# EAGLE design PQ60 CB FV2 (EAGLE 7.4.0)
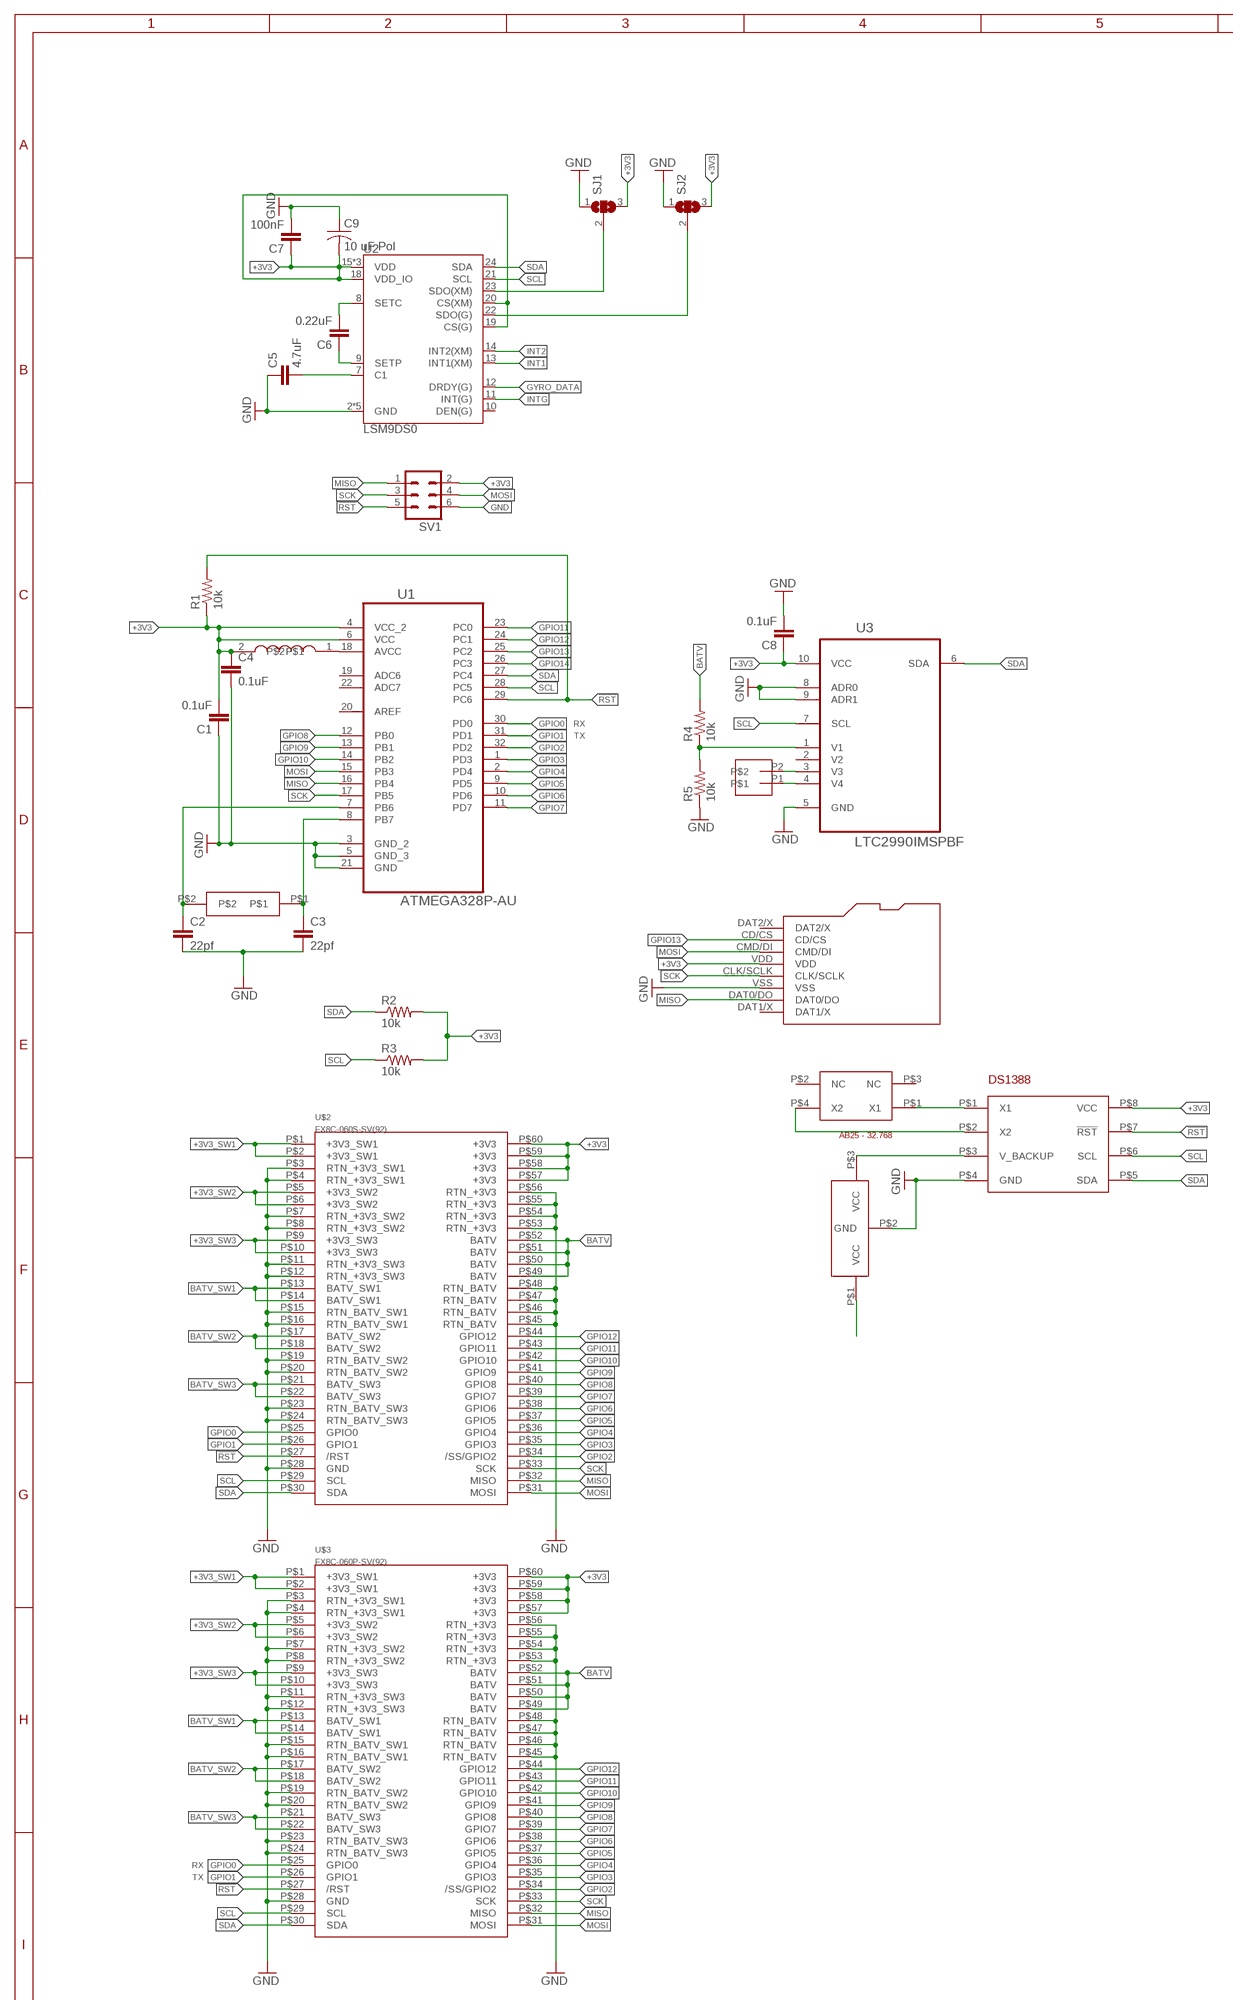
[diagram p0: schematic, sheet 1, part 1 of 2]
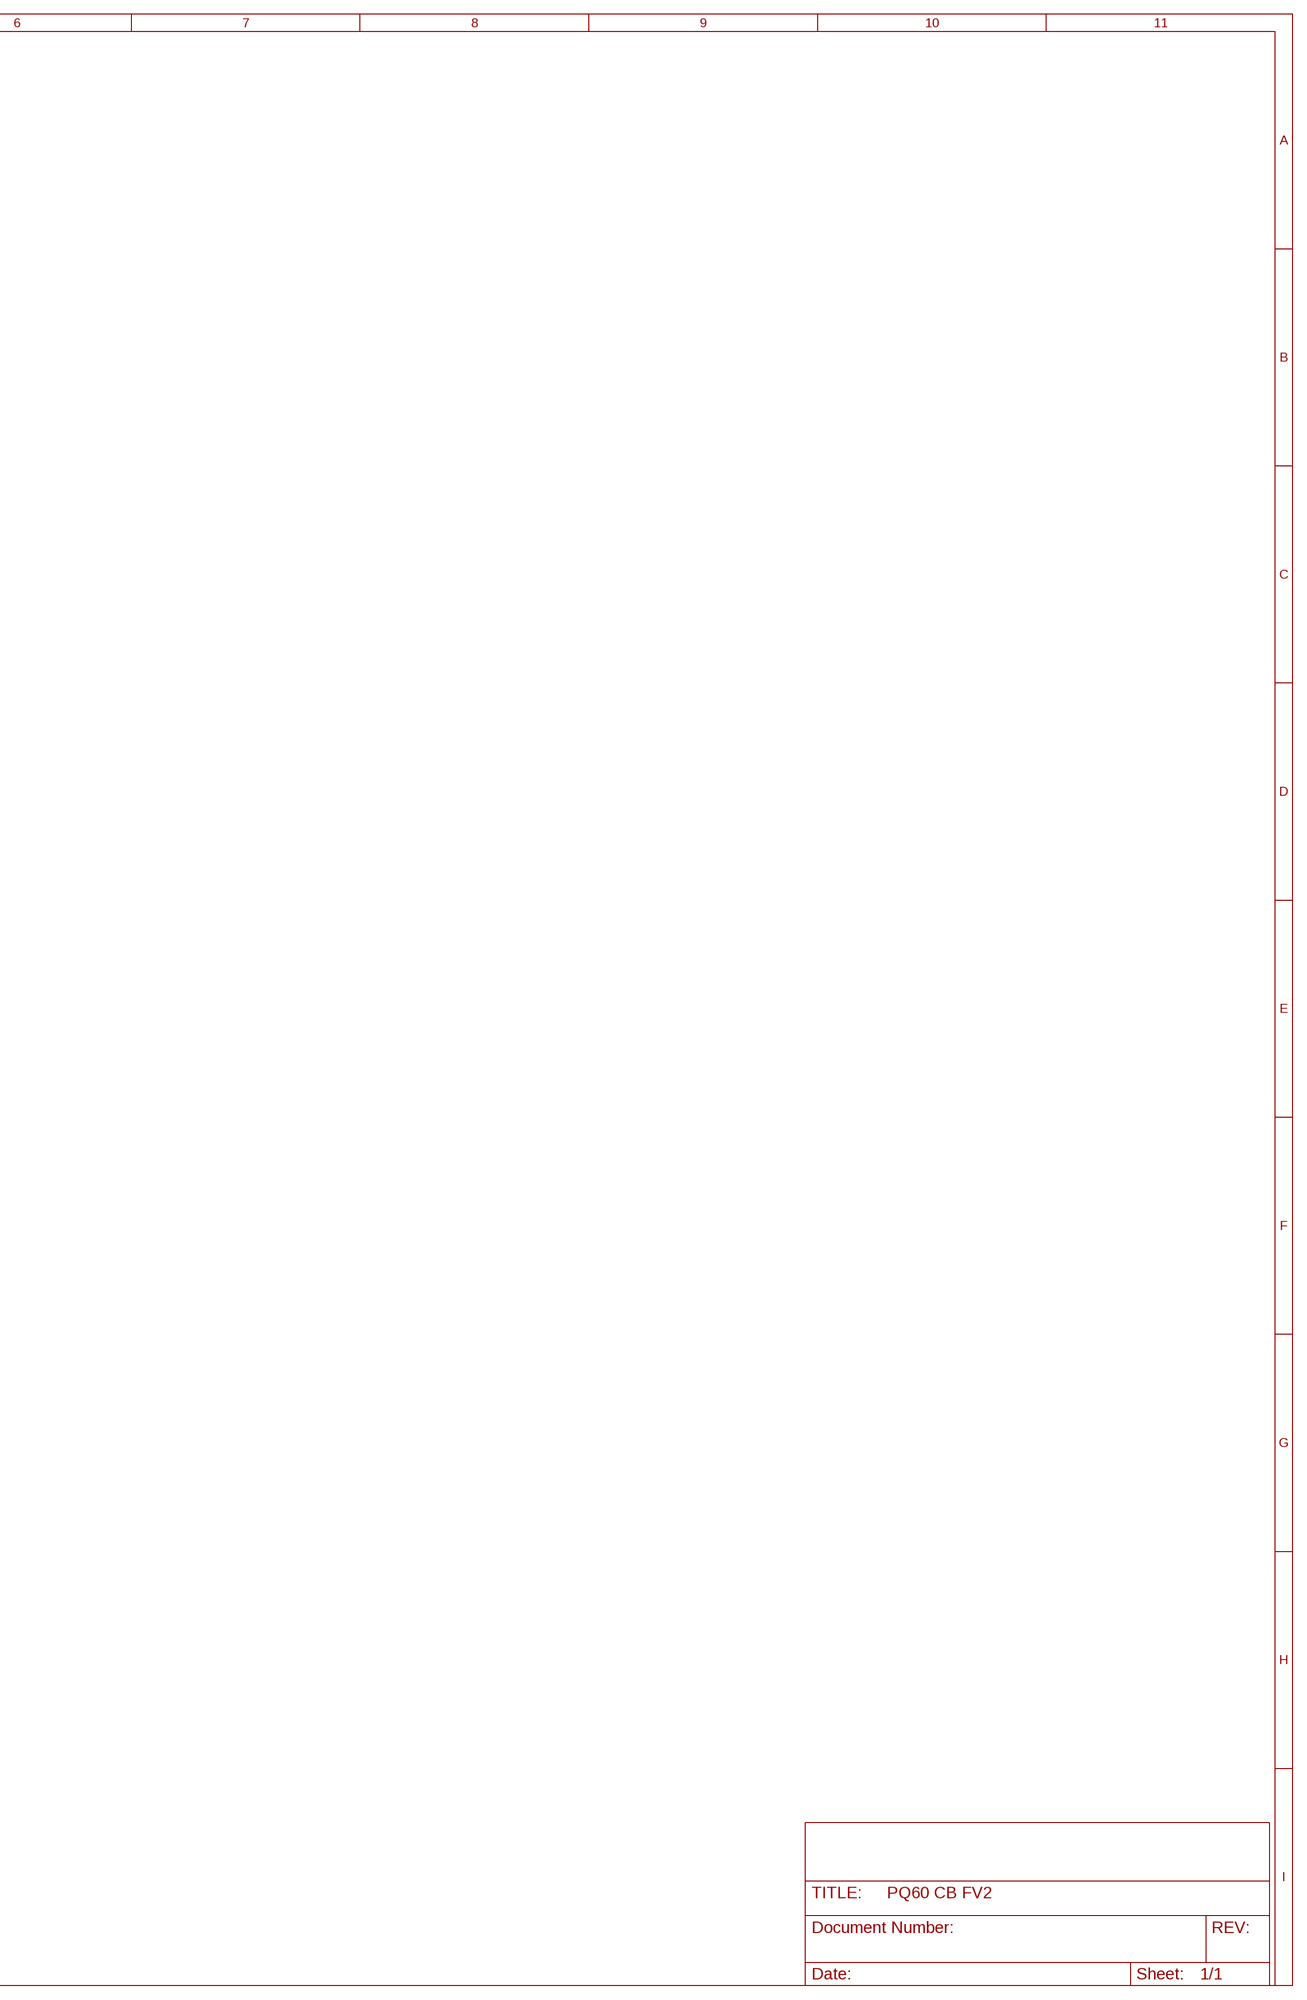
[diagram p1: schematic, sheet 1, part 2 of 2]

## Parts
C1  0.1uF  C-EUC0805  [C0805]
C2  22pf  C-EUC0805  [C0805]
C3  22pf  C-EUC0805  [C0805]
C4  0.1uF  C-EUC0805  [C0805]
C5  4.7uF  C-EUC0805  [C0805]
C6  0.22uF  C-EUC0805  [C0805]
C7  100nF  C-EUC0805  [C0805]
C8  0.1uF  C-EUC0805  [C0805]
C9  10 uF Pol  C-USC0805  [C0805]
R1  10k  R-US_R0805  [R0805]
R2  10k  R-US_M0805  [M0805]
R3  10k  R-US_M0805  [M0805]
R4  10k  R-US_M0805  [M0805]
R5  10k  R-US_M0805  [M0805]
SJ1  SJ2W  [SJ_2]
SJ2  SJ2W  [SJ_2]
SV1  MA03-2  [MA03-2]
U1  ATMEGA328P-AU  [QFP80P900X900X120-32N]
U2  LSM9DS0  [LGA-24]
U3  LTC2990IMSPBF  [SOP50P490X110-10N]
U$2  FX8C-060S-SV(92)  [FX8C-060S-SV(92)]
U$3  FX8C-060P-SV(92)  [FX8C-060P-SV(92)]
U$4  AB3-47699  [ABM#-47699]
U$5  1210-047J  [1210-047J]
U$6  MICROSD  [MICROSD]
U$7  JST-SH-02  [JST-SH-02]
U$8  DS1388  [DS1388]
U$9  AB25  [ABS25]
U$10  6.8MM-BATTERY  [6.8MM-BATTERY]

## Nets
!RST: R1.2 SV1.5 U1.29(PC6) U$2.P$27(/RST) U$3.P$27(/RST) U$8.P$7(!RST)
+3V3: C1.2 C4.1 C7.1 C8.1 C9.2 R1.1 R2.2 R3.2 SJ1.3 SJ2.3 SV1.2 U1.4(VCC_2) U1.6(VCC) U2.15(VDD) U2.16(VDD) U2.17(VDD) U2.18(VDD_IO) U2.19(CS(G)) U2.20(CS(XM)) U3.10(VCC) U$2.P$57(+3V3) U$2.P$58(+3V3) U$2.P$59(+3V3) U$2.P$60(+3V3) U$3.P$57(+3V3) U$3.P$58(+3V3) U$3.P$59(+3V3) U$3.P$60(+3V3) U$5.2 U$6.VDD U$8.P$8(VCC)
+3V3_SW1: U$2.P$1(+3V3_SW1) U$2.P$2(+3V3_SW1) U$3.P$1(+3V3_SW1) U$3.P$2(+3V3_SW1)
+3V3_SW2: U$2.P$5(+3V3_SW2) U$2.P$6(+3V3_SW2) U$3.P$5(+3V3_SW2) U$3.P$6(+3V3_SW2)
+3V3_SW3: U$2.P$9(+3V3_SW3) U$2.P$10(+3V3_SW3) U$3.P$9(+3V3_SW3) U$3.P$10(+3V3_SW3)
BATV: R4.2 U$2.P$49(BATV) U$2.P$50(BATV) U$2.P$51(BATV) U$2.P$52(BATV) U$3.P$49(BATV) U$3.P$50(BATV) U$3.P$51(BATV) U$3.P$52(BATV)
BATV_SW1: U$2.P$13(BATV_SW1) U$2.P$14(BATV_SW1) U$3.P$13(BATV_SW1) U$3.P$14(BATV_SW1)
BATV_SW2: U$2.P$17(BATV_SW2) U$2.P$18(BATV_SW2) U$3.P$17(BATV_SW2) U$3.P$18(BATV_SW2)
BATV_SW3: U$2.P$21(BATV_SW3) U$2.P$22(BATV_SW3) U$3.P$21(BATV_SW3) U$3.P$22(BATV_SW3)
GND: C1.1 C2.2 C3.2 C4.2 C5.1 C7.2 C8.2 C9.1 R5.1 SJ1.1 SJ2.1 SV1.6 U1.3(GND_2) U1.5(GND_3) U1.21(GND) U2.2(GND) U2.3(GND) U2.4(GND) U2.5(GND) U2.6(GND) U3.5(GND) U3.8(ADR0) U3.9(ADR1) U$2.P$3(RTN_+3V3_SW1) U$2.P$4(RTN_+3V3_SW1) U$2.P$7(RTN_+3V3_SW2) U$2.P$8(RTN_+3V3_SW2) U$2.P$11(RTN_+3V3_SW3) U$2.P$12(RTN_+3V3_SW3) U$2.P$15(RTN_BATV_SW1) U$2.P$16(RTN_BATV_SW1) U$2.P$19(RTN_BATV_SW2) U$2.P$20(RTN_BATV_SW2) U$2.P$23(RTN_BATV_SW3) U$2.P$24(RTN_BATV_SW3) U$2.P$28(GND) U$2.P$45(RTN_BATV) U$2.P$46(RTN_BATV) U$2.P$47(RTN_BATV) U$2.P$48(RTN_BATV) U$2.P$53(RTN_+3V3) U$2.P$54(RTN_+3V3) U$2.P$55(RTN_+3V3) U$2.P$56(RTN_+3V3) U$3.P$3(RTN_+3V3_SW1) U$3.P$4(RTN_+3V3_SW1) U$3.P$7(RTN_+3V3_SW2) U$3.P$8(RTN_+3V3_SW2) U$3.P$11(RTN_+3V3_SW3) U$3.P$12(RTN_+3V3_SW3) U$3.P$15(RTN_BATV_SW1) U$3.P$16(RTN_BATV_SW1) U$3.P$19(RTN_BATV_SW2) U$3.P$20(RTN_BATV_SW2) U$3.P$23(RTN_BATV_SW3) U$3.P$24(RTN_BATV_SW3) U$3.P$28(GND) U$3.P$45(RTN_BATV) U$3.P$46(RTN_BATV) U$3.P$47(RTN_BATV) U$3.P$48(RTN_BATV) U$3.P$53(RTN_+3V3) U$3.P$54(RTN_+3V3) U$3.P$55(RTN_+3V3) U$3.P$56(RTN_+3V3) U$6.VSS U$8.P$4(GND) U$10.P$2(GND)
GPIO0: U1.30(PD0) U$2.P$25(GPIO0) U$3.P$25(GPIO0)
GPIO1: U1.31(PD1) U$2.P$26(GPIO1) U$3.P$26(GPIO1)
GPIO2: U1.32(PD2) U$2.P$34(/SS/GPIO2) U$3.P$34(/SS/GPIO2)
GPIO3: U1.1(PD3) U$2.P$35(GPIO3) U$3.P$35(GPIO3)
GPIO4: U1.2(PD4) U$2.P$36(GPIO4) U$3.P$36(GPIO4)
GPIO5: U1.9(PD5) U$2.P$37(GPIO5) U$3.P$37(GPIO5)
GPIO6: U1.10(PD6) U$2.P$38(GPIO6) U$3.P$38(GPIO6)
GPIO7: U1.11(PD7) U$2.P$39(GPIO7) U$3.P$39(GPIO7)
GPIO8: U1.12(PB0) U$2.P$40(GPIO8) U$3.P$40(GPIO8)
GPIO9: U1.13(PB1) U$2.P$41(GPIO9) U$3.P$41(GPIO9)
GPIO10: U1.14(PB2) U$2.P$42(GPIO10) U$3.P$42(GPIO10)
GPIO11: U1.23(PC0) U$2.P$43(GPIO11) U$3.P$43(GPIO11)
GPIO12: U1.24(PC1) U$2.P$44(GPIO12) U$3.P$44(GPIO12)
GPIO13: U1.25(PC2) U$6.CD/CS
GPIO14: U1.26(PC3)
GYRO_DATA: U2.12(DRDY(G))
INT1: U2.13(INT1(XM))
INT2: U2.14(INT2(XM))
INTG: U2.11(INT(G))
MISO: SV1.1 U1.16(PB4) U$2.P$32(MISO) U$3.P$32(MISO) U$6.DAT0/DO
MOSI: SV1.4 U1.15(PB3) U$2.P$31(MOSI) U$3.P$31(MOSI) U$6.CMD/DI
N$1: R4.1 R5.2 U3.1(V1)
N$2: C3.1 U1.8(PB7) U$4.P$1
N$3: C2.1 U1.7(PB6) U$4.P$2
N$4: U1.18(AVCC) U$5.1
N$5: C5.2 U2.7(C1)
N$6: C6.2 U2.8(SETC)
N$7: C6.1 U2.9(SETP)
N$8: SJ1.2 U2.23(SDO(XM))
N$9: SJ2.2 U2.22(SDO(G))
N$10: U3.3(V3) U$7.P2
N$11: U3.4(V4) U$7.P1
N$14: U$10.P$1(VCC)
N$18: U$8.P$1(X1) U$9.P$1(X1)
N$19: U$8.P$2(X2) U$9.P$4(X2)
N$20: U$8.P$3(V_BACKUP) U$10.P$3(VCC)
SCK: SV1.3 U1.17(PB5) U$2.P$33(SCK) U$3.P$33(SCK) U$6.CLK/SCLK
SCL: R3.1 U1.28(PC5) U2.21(SCL) U3.7(SCL) U$2.P$29(SCL) U$3.P$29(SCL) U$8.P$6(SCL)
SDA: R2.1 U1.27(PC4) U2.24(SDA) U3.6(SDA) U$2.P$30(SDA) U$3.P$30(SDA) U$8.P$5(SDA)
Unconnected: U1.19(ADC6) U1.20(AREF) U1.22(ADC7) U2.10(DEN(G)) U3.2(V2) U$6.DAT1/X U$6.DAT2/X U$9.P$2(NC) U$9.P$3(NC)

## Notes on the sheet
- RX
- TX
- RX
- TX

## Library data of the parts
C1-C4 = resistor:C-EU: CAPACITOR, European symbol
C5-C8 = rcl:C-EU: CAPACITOR, European symbol
C9 = adafruit:C-US: CAPACITOR, American symbol
R1-R3 = adafruit:R-US_: RESISTOR, American symbol
R4 R5 = resistor:R-US_: RESISTOR, American symbol
SJ1 SJ2 = jumper:SJ2W: SMD solder JUMPER
SV1 = con-lstb:MA03-2: PIN HEADER; OC_FARNELL: unknown; OC_NEWARK: unknown
U1 = atmega328p:ATMEGA328P-AU: 8-bit Microcontroller with In-System Programmable Flash; MPN: ATMEGA328P-AU; OC_FARNELL: 1715486; OC_NEWARK: 14R4631; PACKAGE: TQFP-32; SUPPLIER: Atmel
U2 = SparkFun-DigitalIC:LSM9DS0: LSM9DS0 3D Accelerometer, 3D Gyroscope, 3D Magnetomter Features: 3 acceleration channels, 3 angular rate channels, 3 magnetic field channels ±2/±4/±6/±8/±16 g linear acceleration full scale ±2/±4/±8/±12 gauss magnetic full scale ±245/±500/±2000 dps angular rate full scale 16-bit data output SPI / I2C serial interfaces Analog supply voltage 2.4 V to 3.6 V Power-down mode / low-power mode Programmable interrupt generators Embedded self-test Embedded temperature sensor Embedded FIFO Position and motion detection functions Click/double-click recognition
U3 = LTC2990:LTC2990IMSPBF: I2C Temperature, Voltage and Current Monitor; MPN: LTC2990IMS#PBF; OC_FARNELL: 1898629; OC_NEWARK: 13T3889; PACKAGE: MSOP-10; SUPPLIER: Linear Technology
U$2 = PQ60:FX8C-060S-SV(92)
U$3 = PQ60:FX8C-060P-SV(92)
U$4 = abm3-16:AB3-47699
U$5 = 1210-047J:1210-047J
U$6 = mircosd:MICROSD
U$7 = JST SH 02:JST-SH-02
U$8 = DS1388:DS1388
U$9 = AB25:AB25
U$10 = 6.8mm-battery:6.8MM-BATTERY

## Net classes
0 default: clearance 0.205 mm

## Board
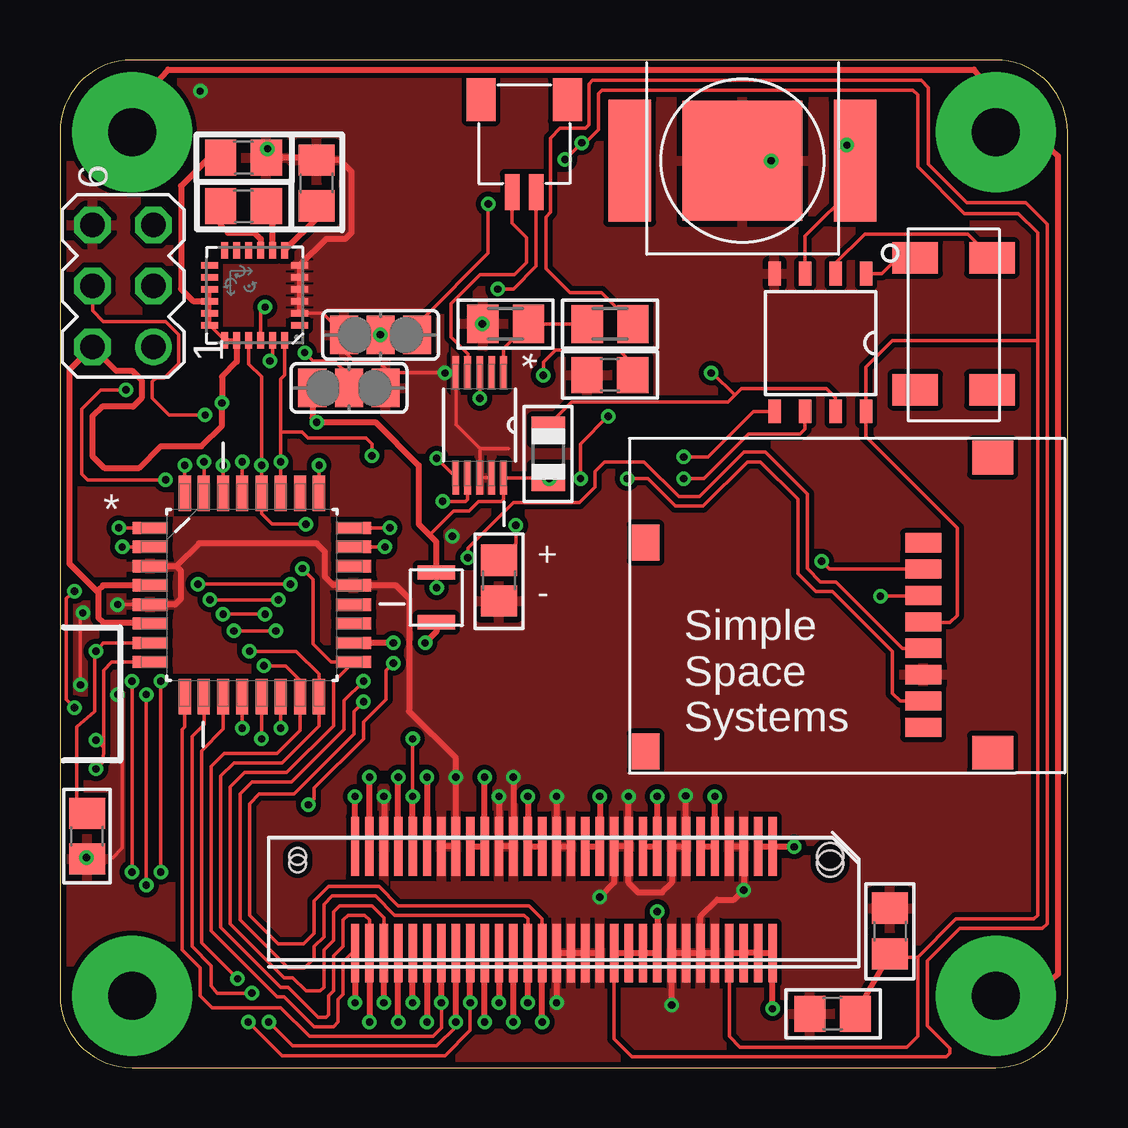
[diagram p2: board, top side]
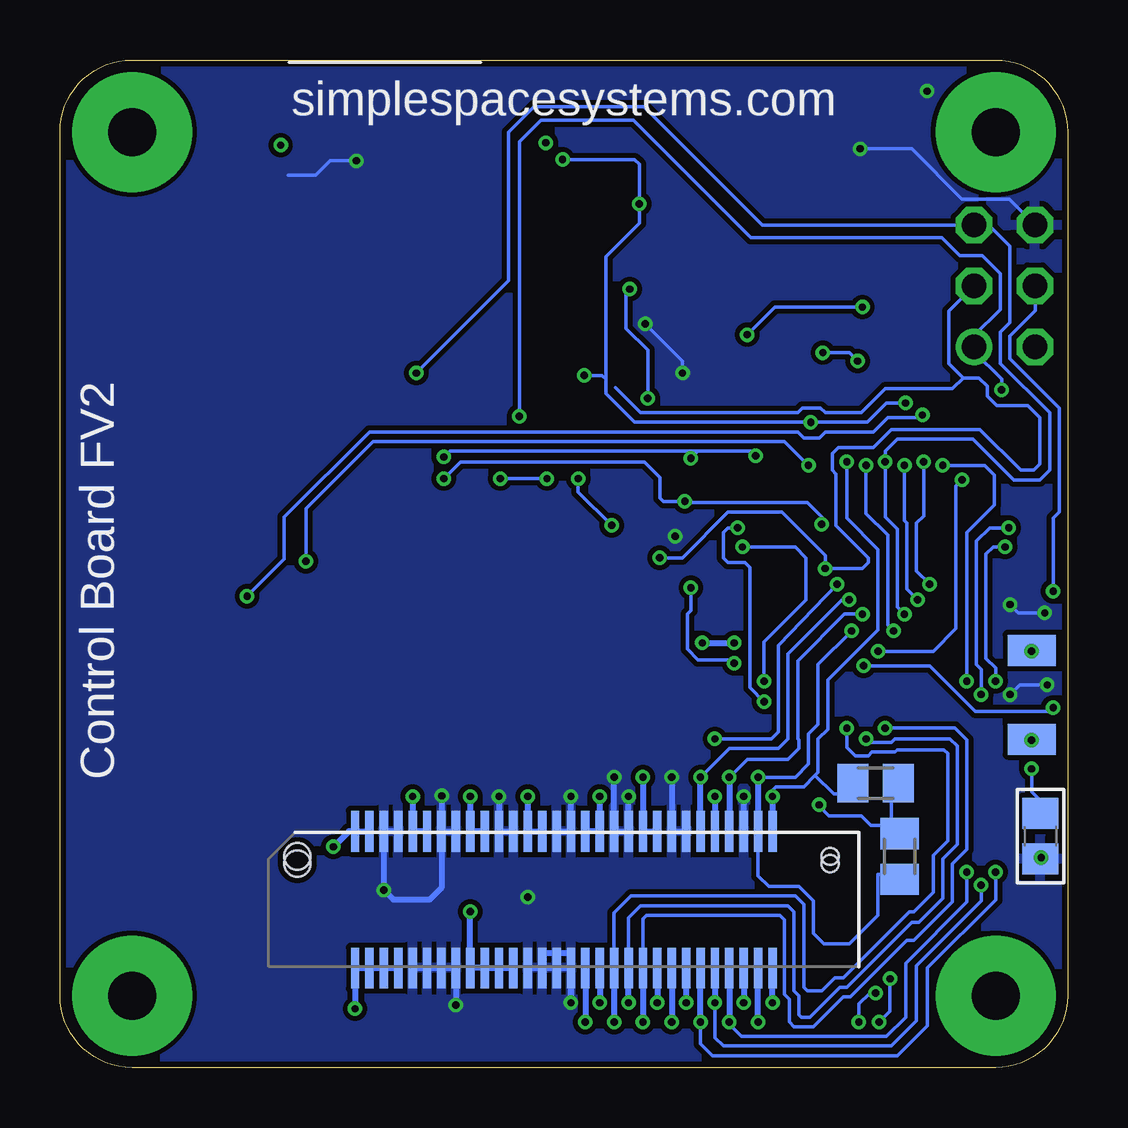
[diagram p3: board, bottom side, seen from below]

Size 42 x 42 mm. Coordinates in mm from the lower left corner, seen from the top.
Outline: 42,3 42,39 arc90 39,42 3,42 arc90 0,39 0,3 arc90 3,0 39,0 arc90 42,3
Copper layers (1*16): Top 0.035mm / dielectric 1.5mm / Bottom 0.035mm
Design rules "SeeedStudio_2layer_DRU_no_angle_20140221 *": minimum track width 6mil, minimum drill 0.3mm, track to track 6mil, track to pad 6mil, pad to pad 6mil, via to via 6mil, smd to smd 0mil, copper to edge 10mil, drill to drill 10mil, minimum pad ring 10mil, minimum via ring 6mil, stop-mask expansion 2mil, vias tented up to drill 100mil, thermal gap 10mil

### Footprints (pad centres in the part's own frame; a part is rotated, then mirrored left to right if it is on the bottom)
C0805 = smd 1.3 x 1.5: 1 -0.95,0; 2 0.95,0
C0805' = smd 1.3 x 1.5: 1 -0.85,0; 2 0.85,0
R0805 = smd 1.1 x 1.4: 1 -1,0; 2 1,0
M0805 = smd 1.3 x 1.6: 1 -0.95,0; 2 0.95,0
SJ_2 = smd 1.168 x 1.6: 1 -1.524,0; 2 0,0; 3 1.524,0
MA03-2 = drill 1.016: 1 -2.54,-1.27 | drill 1.016 octagon: 2 -2.54,1.27; 3 0,-1.27; 4 0,1.27; 5 2.54,-1.27; 6 2.54,1.27
QFP80P900X900X120-32N = smd 1.473 x 0.508: 1 -4.242,2.794; 2 -4.242,2.007; 3 -4.242,1.194; 4 -4.242,0.406; 5 -4.242,-0.406; 6 -4.242,-1.194; 7 -4.242,-2.007; 8 -4.242,-2.794; 17 4.242,-2.794; 18 4.242,-2.007; 19 4.242,-1.194; 20 4.242,-0.406; 21 4.242,0.406; 22 4.242,1.194; 23 4.242,2.007; 24 4.242,2.794 | smd 0.508 x 1.473: 9 -2.794,-4.242; 10 -2.007,-4.242; 11 -1.194,-4.242; 12 -0.406,-4.242; 13 0.406,-4.242; 14 1.194,-4.242; 15 2.007,-4.242; 16 2.794,-4.242; 25 2.794,4.242; 26 2.007,4.242; 27 1.194,4.242; 28 0.406,4.242; 29 -0.406,4.242; 30 -1.194,4.242; 31 -2.007,4.242; 32 -2.794,4.242
LGA-24 = smd 0.7 x 0.29: 1 -1.875,1.25; 2 -1.875,0.75; 3 -1.875,0.25; 4 -1.875,-0.25; 5 -1.875,-0.75; 6 -1.875,-1.25; 13 1.875,-1.25; 14 1.875,-0.75; 15 1.875,-0.25; 16 1.875,0.25; 17 1.875,0.75; 18 1.875,1.25 | smd 0.29 x 0.7: 7 -1.25,-1.875; 8 -0.75,-1.875; 9 -0.25,-1.875; 10 0.25,-1.875; 11 0.75,-1.875; 12 1.25,-1.875; 19 1.25,1.875; 20 0.75,1.875; 21 0.25,1.875; 22 -0.25,1.875; 23 -0.75,1.875; 24 -1.25,1.875
SOP50P490X110-10N = smd 1.397 x 0.279: 1 -2.184,0.991; 2 -2.184,0.508; 3 -2.184,0; 4 -2.184,-0.508; 5 -2.184,-0.991; 6 2.184,-0.991; 7 2.184,-0.508; 8 2.184,0; 9 2.184,0.508; 10 2.184,0.991
FX8C-060S-SV(92) = smd 0.35 x 1.7: P$1 -8.7,2.85; P$2 -8.1,2.85; P$3 -7.5,2.85; P$4 -6.9,2.85; P$5 -6.3,2.85; P$6 -5.7,2.85; P$7 -5.1,2.85; P$8 -4.5,2.85; P$9 -3.9,2.85; P$10 -3.3,2.85; P$11 -2.7,2.85; P$12 -2.1,2.85; P$13 -1.5,2.85; P$14 -0.9,2.85; P$15 -0.3,2.85; P$16 0.3,2.85; P$17 0.9,2.85; P$18 1.5,2.85; P$19 2.1,2.85; P$20 2.7,2.85; P$21 3.3,2.85; P$22 3.9,2.85; P$23 4.5,2.85; P$24 5.1,2.85; P$25 5.7,2.85; P$26 6.3,2.85; P$27 6.9,2.85; P$28 7.5,2.85; P$29 8.1,2.85; P$30 8.7,2.85; P$31 8.7,-2.85; P$32 8.1,-2.85; P$33 7.5,-2.85; P$34 6.9,-2.85; P$35 6.3,-2.85; P$36 5.7,-2.85; P$37 5.1,-2.85; P$38 4.5,-2.85; P$39 3.9,-2.85; P$40 3.3,-2.85; P$41 2.7,-2.85; P$42 2.1,-2.85; P$43 1.5,-2.85; P$44 0.9,-2.85; P$45 0.3,-2.85; P$46 -0.3,-2.85; P$47 -0.9,-2.85; P$48 -1.5,-2.85; P$49 -2.1,-2.85; P$50 -2.7,-2.85; P$51 -3.3,-2.85; P$52 -3.9,-2.85; P$53 -4.5,-2.85; P$54 -5.1,-2.85; P$55 -5.7,-2.85; P$56 -6.3,-2.85; P$57 -6.9,-2.85; P$58 -7.5,-2.85; P$59 -8.1,-2.85; P$60 -8.7,-2.85 | hole 1.1: -11.1,1.8 | hole 0.7: 11.1,1.8
FX8C-060P-SV(92) = smd 0.35 x 2.45: P$1 -8.7,-2.225; P$2 -8.1,-2.225; P$3 -7.5,-2.225; P$4 -6.9,-2.225; P$5 -6.3,-2.225; P$6 -5.7,-2.225; P$7 -5.1,-2.225; P$8 -4.5,-2.225; P$9 -3.9,-2.225; P$10 -3.3,-2.225; P$11 -2.7,-2.225; P$12 -2.1,-2.225; P$13 -1.5,-2.225; P$14 -0.9,-2.225; P$15 -0.3,-2.225; P$16 0.3,-2.225; P$17 0.9,-2.225; P$18 1.5,-2.225; P$19 2.1,-2.225; P$20 2.7,-2.225; P$21 3.3,-2.225; P$22 3.9,-2.225; P$23 4.5,-2.225; P$24 5.1,-2.225; P$25 5.7,-2.225; P$26 6.3,-2.225; P$27 6.9,-2.225; P$28 7.5,-2.225; P$29 8.1,-2.225; P$30 8.7,-2.225; P$31 8.7,2.225; P$32 8.1,2.225; P$33 7.5,2.225; P$34 6.9,2.225; P$35 6.3,2.225; P$36 5.7,2.225; P$37 5.1,2.225; P$38 4.5,2.225; P$39 3.9,2.225; P$40 3.3,2.225; P$41 2.7,2.225; P$42 2.1,2.225; P$43 1.5,2.225; P$44 0.9,2.225; P$45 0.3,2.225; P$46 -0.3,2.225; P$47 -0.9,2.225; P$48 -1.5,2.225; P$49 -2.1,2.225; P$50 -2.7,2.225; P$51 -3.3,2.225; P$52 -3.9,2.225; P$53 -4.5,2.225; P$54 -5.1,2.225; P$55 -5.7,2.225; P$56 -6.3,2.225; P$57 -6.9,2.225; P$58 -7.5,2.225; P$59 -8.1,2.225; P$60 -8.7,2.225 | hole 1.1: -11.1,-1.5 | hole 0.7: 11.1,-1.5
ABM#-47699 = smd 1.3 x 2: P$1 0,0; P$2 3.7,0
1210-047J = smd 0.6 x 1.55: 1 1.78,0; 2 -0.3,0
MICROSD = smd 0.8 x 1.5: CD/CS 5.35,-3.75; CLK/SCLK 8.65,-3.75; CMD/DI 6.45,-3.75; DAT0/DO 10.85,-3.75; DAT1/X 11.95,-3.75; DAT2/X 4.25,-3.75; VDD 7.55,-3.75; VSS 9.75,-3.75 | smd 1.4 x 1.7: P$1 0.7,-0.85; P$2 13,-0.85 | smd 1.5 x 1.15: P$11 12.95,-15.32; P$12 4.25,-15.32
JST-SH-02 = smd 0.6 x 1.5: P1 -0.5,-2.35; P2 0.5,-2.35 | smd 1.2 x 1.8: P$1 1.8,1.5; P$2 -1.8,1.5
DS1388 = smd 0.51 x 0.99: P$1 -1.9,-3.04; P$2 -0.63,-3.04; P$3 0.64,-3.04; P$4 1.91,-3.04; P$5 1.91,2.7; P$6 0.64,2.7; P$7 -0.63,2.7; P$8 -1.9,2.7
ABS25 = smd 1.3 x 1.9: P$1 0,-3.2; P$2 5.5,-3.2; P$3 5.5,0; P$4 0,0
6.8MM-BATTERY = smd 1.78 x 5.08: P$1 0,0; P$3 9.4,0 | smd 5 x 5: P$2 4.7,0

### Placement (x,y rotation side)
C1  34.6,5.69 270 top
C2  1.13,9.65 270 top
C3  1.13,9.65 270 bottom
C4  32.21,2.25 180 top
C5  10.7,36.87 270 top
C6  7.65,35.9 0 top
C7  7.65,37.93 0 top
C8  22.92,28.87 180 top
C9  10 uF Pol  [C0805']  18.3,20.3 90 top
R1  20.36,25.58 90 top
R2  8,11.85 0 bottom
R3  7,8.8 90 bottom
R4  22.93,30.99 0 top
R5  18.58,31.01 0 top
SJ1  12.05,28.33 180 top
SJ2  13.37,30.54 0 top
SV1  2.63,32.58 90 top
U1  8,19.7 0 top
U2  8.12,32.19 180 top
U3  17.5,26.78 270 top
U$2  21,7 0 bottom
U$3  21,7 180 top
U$4  1.5,13.68 90 bottom
U$5  15.69,20.34 270 top
U$6  39.73,26.13 270 top
U$7  19.35,38.85 0 top
U$8  31.7,30.05 180 top
U$9  38.85,33.75 270 top
U$10  23.75,37.8 0 top

### Tracks (layer width: path | path; a pad name or v marks a point on that pad's centre or on a via)
!RST  (via drill 0.3, 0.3 pad 0.3)
  Top 0.152: v6.8,18.9 v8.55,18.9 | v7.6,25.25 U1.29 | U$8.P$7 32.33,27.92 31.95,28.3 28.4,28.3 28.12,28.02 | v27.15,28.95 27.2,28.95 28.12,28.02 | R1.2 20.36,26.78 21.33,27.75 27.85,27.75 28.12,28.02
  Top 0.254: U$3.P$27 v14.1,12.1
  Bottom 0.152: v14.1,12.1 13.35,12.85 11.65,12.85 11.2,13.3 11.2,13.65 11.25,13.7 11.25,16.95 9.3,18.9 v8.55,18.9 | v6.8,18.9 7.1,19.2 7.1,22.45 7.6,22.95 v7.6,25.25 7.6,25.7 7.1,26.2 3.95,26.2 2.25,24.5 1.15,24.5 0.75,24.9 0.75,27.3 2.8,29.35 2.8,30.65 2.4,31.05 2.4,34.25 3.27,35.12 SV1.5 12.72,35.12 17.65,40.05 22.25,40.05 23.3,39 23.3,32.8 v27.15,28.95
  Bottom 0.254: v14.1,12.1 U$2.P$27
+3V3  (via drill 0.3, 0.3 pad 0.3)
  Top 0.152: U2.20 U2.19 U2.18 U2.17 U2.16 U2.15 | 29.71,2.44 v29.7,2.45 | 1.57,19.93 1.6,19.9 | 15.4,22.2 16.4,23.2 17.05,23.2 17.45,23.6 18.4,23.6 18.49,23.69 U3.10 R1.1 20.39,24.45 v20.4,24.55 | U$3.P$57 27.9,1.3 28.35,0.85 35.3,0.85 35.75,1.3 35.75,4.6 | 35.75,4.6 37.35,6.2 40.6,6.2 40.75,6.35 40.75,30.35 | 40.75,30.35 40.75,34.8 39.95,35.6 37.7,35.6 35.75,37.55 35.75,40.55 35.55,40.75 22.6,40.75 22.45,40.6 22.45,39.1 21.9,38.55 v21.75,38.55 v21.05,37.85 | v10.35,10.95 10.6,11.2 10.6,11.65 12.65,13.7 12.65,14.4 13.6,15.35 13.6,16.55 v13.9,16.85 | v15.7,20 15.69,20.01 U$5.2 | 35.75,4.6 34.6,4.6 C1.2 | 40.75,30.35 40.7,30.3 34.7,30.3 33.6,29.2 U$8.P$8 33.6,26.3 37.4,22.5 37.4,18.85 37.1,18.55 36.01,18.55 U$6.VDD | 20.17,28.87 v20.15,28.85 20.15,29.4 20.65,29.9 23.3,29.9 23.88,29.32 C8.1 | 14.89,30.94 SJ2.3 15.15,30.8 15.15,31.25 17.85,33.95 v17.85,36 | C9.2 19,21.85 v19,22.6
  Top 0.254: U$3.P$57 U$3.P$58 U$3.P$59 U$3.P$60 v29.7,2.45 | U1.4 1.8,20.1 1.6,19.9 1.6,19.8 | 1.6,19.8 1.6,18.75 1.8,18.55 3.71,18.55 U1.6 | 1.6,19.8 0.4,21 0.4,29.09 SV1.2 2.35,29.05 3,29.05 3.4,28.65 3.4,27.9 3.05,27.55 1.75,27.55 1.35,27.15 1.35,25.5 1.85,25 3.3,25 4.2,25.9 5.9,25.9 6.75,26.75 v6.75,27.7 6.75,28.8 7.37,29.42 U2.20 | U$5.2 15.69,21.91 15.4,22.2 14.95,22.65 14.95,25.1 13.15,26.9 v10.7,26.9 10.52,27.08 SJ1.3 | C7.1 6.23,37.93 5.05,36.75 5.05,32.45 5.55,31.95 U2.16 | C1.2 C4.1
  Bottom 0.152: 19.25,28.7 19.25,33.8 17.85,35.2 v17.85,36 17.85,37.65 18.05,37.85 v21.05,37.85 | 19.25,28.7 19.25,28.1 18.05,26.9 v10.7,26.9 8.35,26.9 7.55,27.7 v6.75,27.7 | v15.7,20 15.7,19.05 15.85,18.9 15.85,17.45 15.4,17 14.05,17 v13.9,16.85 | v10.35,10.95 10.35,10.9 9.95,10.5 8.6,10.5 8.2,10.1 7.35,10.1 | R2.2 7.35,11.3 7.35,10.1 | 7.35,10.1 R3.2 | v20.15,28.85 19.4,28.85 19.25,28.7 | v19,22.6 20.4,24 v20.4,24.55
  Bottom 0.254: U$2.P$60 U$2.P$59 U$2.P$58 U$2.P$57 | U$2.P$60 U$3.P$60 | U$2.P$60 v29.7,2.45
+3V3_SW1  (via drill 0.3)
  Top 0.254: v30.6,9.2 29.73,9.2 U$3.P$1 U$3.P$2
  Bottom 0.254: U$2.P$2 U$2.P$1 29.95,9.85 v30.6,9.2
+3V3_SW2  (via drill 0.3)
  Top 0.254: U$3.P$6 U$3.P$5 v27.3,11.3
  Bottom 0.254: U$2.P$6 U$2.P$5 v27.3,11.3
+3V3_SW3  (via drill 0.3)
  Top 0.254: U$3.P$10 U$3.P$9 v24.9,11.3
  Bottom 0.254: U$2.P$10 U$2.P$9 | v24.9,11.3 U$2.P$9 | 24.9,9.1 U$2.P$9
BATV  (via drill 0.3)
  Top 0.152: 23.7,5.49 U$3.P$50 | U$3.P$49 23.1,1.2 23.85,0.45 36.95,0.45 37.1,0.6 37.1,0.8 36.15,1.75 36.15,4.45 37.5,5.8 40.95,5.8 41.15,6 41.15,35.15 40.25,36.05 37.8,36.05 36.2,37.65 36.2,40.85 35.9,41.15 22.2,41.15 22.05,41 22.05,39.3 21.9,39.15 20.85,39.15 20.45,38.75 20.45,35.65 20.25,35.45 20.25,33.3 21.25,32.3 22.57,32.3 R4.2
  Top 0.254: U$3.P$49 U$3.P$50 U$3.P$51 U$3.P$52 | 24.85,4.72 U$3.P$52 | v24.9,6.5 U$3.P$52
  Bottom 0.254: U$2.P$49 U$2.P$50 U$2.P$51 U$2.P$52 v24.9,6.5
BATV_SW1  (via drill 0.3)
  Top 0.254: U$3.P$14 U$3.P$13 v22.5,11.3
  Bottom 0.254: U$2.P$14 U$2.P$13 v22.5,11.3
BATV_SW2  (via drill 0.3)
  Top 0.254: U$3.P$17 U$3.P$18 v19.5,11.3
  Bottom 0.254: U$2.P$17 U$2.P$18 v19.5,11.3
BATV_SW3  (via drill 0.3)
  Top 0.254: U$3.P$22 U$3.P$21 v17.7,12.1
  Bottom 0.254: U$2.P$22 U$2.P$21 v17.7,12.1
CHASSIS_GND  (via drill 2 pad 5)
  Top 0.152: 3,40 v3,39
  Top 0.254: 3,40 4.5,41.6 38.1,41.6 39,40.6 v39,39 40.5,39 41.6,38 41.6,3.9 40.6,3 v39,3
GND  (via drill 0.3)
  Top 0.152: U1.5 v2.4,19.3 | C3.2 1.3,8.95 v1.1,8.75 | v2.4,15.55 2.6,15.35 2.6,9.15 2.2,8.75 | 13.55,29 13.55,29.15 13.25,29.45 12.25,29.45 11.84,29.86 SJ2.1 10.94,31.44 U2.2 | 13.55,29 13.55,28.35 SJ1.1 | U3.5 13.59,28.96 13.55,29 | U3.5 16.5,26.8 17.5,25.8 | 17.5,25.8 U3.8 U3.9 | 18.7,25.8 17.5,25.8 | v17.6,31 R5.1 | U3.5 16.5,29 v16.05,28.95 | v0.95,18.95 0.85,18.85 v0.85,15.95
  Top 0.254: U$3.P$48 U$3.P$47 U$3.P$46 U$3.P$45 v20.7,2.7 | U$3.P$55 U$3.P$54 U$3.P$53 v25.5,2.6 | U$3.P$55 U$3.P$56 | U$3.P$24 U$3.P$23 v16.5,12.1 16.5,12.9 14.55,14.85 14.55,19.55 13.99,20.11 U1.21 11.39,20.11 11.05,20.45 11.05,21.5 10.7,21.85 5.8,21.85 4.85,20.9 | v18.3,11.3 U$3.P$20 U$3.P$19 v18.9,12.1 | U$3.P$15 U$3.P$16 v20.7,11.3 | U$3.P$11 U$3.P$12 23.1,7.7 v22.5,7.1 | U$3.P$11 v23.7,11.3 | U$3.P$4 U$3.P$3 v28.5,7.4 28.1,7 27.4,7 26.7,6.3 U$3.P$55 | U$3.P$11 23.7,7.7 24.1,7.3 25.1,7.3 25.5,7.7 U$3.P$8 U$3.P$7 26.1,11.31 v26.09,11.33 | U2.2 U2.3 U2.4 U2.5 U2.6 11.11,34.55 11.9,34.55 12.15,34.8 12.15,37.35 11.68,37.82 C5.1 10.59,37.93 C7.2 8.65,37.98 v8.65,38.3 | v13.5,11.3 U$3.P$28 | U1.3 4.85,20.9 | 4.85,20.9 5.05,20.7 5.05,19.55 4.8,19.3 U1.5
  Bottom 0.152: C3.2 1.13,8.72 v1.1,8.75 | SV1.6 2.44,36.2 4.4,36.2 6.5,38.3 v8.65,38.3 | v16.05,28.95 16.05,29.45 v17.6,31 | v29.65,37.8 30.75,37.8 31.35,37.2 32.48,37.2 | 2.5,19.3 v2.4,19.3 2.05,18.95 v0.95,18.95 | v2.4,15.55 2,15.95 v0.85,15.95
  Bottom 0.254: U$2.P$24 U$2.P$23 v16.5,12.1 | U$2.P$15 U$2.P$16 v20.7,11.3 | U$2.P$12 U$2.P$11 v23.7,11.3 | U$2.P$7 U$2.P$8 | U$2.P$4 U$2.P$3 v28.5,7.4 28.1,7 26.6,7 26.1,7.5 U$2.P$7 | U$2.P$48 U$2.P$47 U$2.P$46 U$2.P$45 v20.7,2.7 U$3.P$45 U$3.P$47 | U$2.P$56 U$2.P$55 U$2.P$54 U$2.P$53 v25.5,2.6 | v18.3,11.3 U$2.P$20 U$2.P$19 v18.9,12.1 | v26.09,11.33 26.09,9.86 U$2.P$7 | U$2.P$28 v13.5,11.3
  other vias: 5.85,40.7 16.35,22.15
  pour Bottom: 38.73,42.04 3.1,42.04 arc90 -0.08,38.86 -0.08,2.92 arc90 2.82,0.03 38.79,0.03 arc90 42.01,3.25 42.01,38.91 arc90 38.89,42.04
  pour Top: 39.17,42.01 3.07,42.01 arc90 -0.1,38.84 -0.1,3.02 arc90 2.9,0.03 38.89,0.03 arc90 42.04,3.17 42.04,39.24 arc90 39.32,41.96
GPIO0  (via drill 0.3)
  Top 0.152: v6.8,25.1 U1.30 | v9.1,19.5 v6.25,19.5
  Top 0.254: v15.3,12.1 U$3.P$25
  Bottom 0.152: v15.3,12.1 14.1,13.3 12.05,13.3 11.65,13.7 11.65,17.25 9.4,19.5 v9.1,19.5 | v6.8,25.1 6.8,22.8 6.7,22.7 6.7,19.95 v6.25,19.5
  Bottom 0.254: U$2.P$25 v15.3,12.1
GPIO1  (via drill 0.3)
  Top 0.152: v5.75,20.15 v9.6,20.15 | v14.7,13.7 v14.7,11.3 | v6,25.25 U1.31
  Top 0.254: U$3.P$26 v14.7,11.3
  Bottom 0.152: v5.75,20.15 6.3,20.7 6.3,22.7 6,23 v6,25.25 | v9.6,20.15 12.05,17.6 12.05,14 12.35,13.7 v14.7,13.7
  Bottom 0.254: v14.7,11.3 U$2.P$26
GPIO2  (via drill 0.3)
  Top 0.152: U1.32 v5.2,25.1 | v4.2,16.1 v4.2,8.15
  Top 0.254: v14.1,1.9 U$3.P$34
  Bottom 0.152: v14.1,1.9 14.1,1.8 13.6,1.3 7.55,1.3 6.75,2.1 6.75,4.35 4.2,6.9 v4.2,8.15 | v4.2,16.1 4.2,22.3 3.05,23.45 3.05,24.7 3.45,25.1 v5.2,25.1
  Bottom 0.254: U$2.P$34 v14.1,1.9
GPIO3  (via drill 0.3)
  Top 0.152: v2.45,22.5 U1.1 | v3.6,7.6 v3.6,15.55
  Top 0.254: v14.7,2.7 U$3.P$35
  Bottom 0.152: v14.7,2.7 14.7,1.25 14.35,0.9 7.35,0.9 6.3,1.95 6.3,4.25 3.6,6.95 v3.6,7.6 | v2.45,22.5 3.25,22.5 3.8,21.95 3.8,16.8 3.6,16.6 v3.6,15.55
  Bottom 0.254: U$2.P$35 v14.7,2.7
GPIO4  (via drill 0.3)
  Top 0.152: v2.6,21.7 U1.2 | v3,8.15 v3,16.1
  Top 0.254: U$3.P$36 v15.3,1.9
  Bottom 0.152: v15.3,1.9 15.3,1 14.8,0.5 7.1,0.5 5.85,1.75 5.85,4.15 3,7 v3,8.15 | v2.6,21.7 3.1,21.7 3.4,21.4 3.4,17.05 3,16.65 v3,16.1
  Bottom 0.254: v15.3,1.9 U$2.P$36
GPIO5  (via drill 0.3)
  Top 0.152: U$3.P$37 15.9,1.65 15.55,1.3 10.4,1.3 9.2,2.5 6.35,2.5 5.85,3 5.85,4.15 5.1,4.9 5.1,14.1 5.21,14.21 U1.9
  Top 0.254: v15.9,2.7 U$3.P$37
  Bottom 0.254: U$2.P$37 v15.9,2.7
GPIO6  (via drill 0.3)
  Top 0.152: U$3.P$38 16.5,1.7 15.7,0.9 9.7,0.9 v8.7,1.9 | U1.10 6,14.3 5.5,13.8 5.5,5.05 6.3,4.25 6.3,3.4 6.55,3.1 v8,3.1
  Top 0.254: v16.5,1.9 U$3.P$38
  Bottom 0.152: v8,3.1 8.25,3.1 8.7,2.65 v8.7,1.9
  Bottom 0.254: U$2.P$38 v16.5,1.9
GPIO7  (via drill 0.3)
  Top 0.152: U$3.P$39 17.1,1.55 16.05,0.5 9.25,0.5 v7.85,1.9 | U1.11 6.81,14.11 5.9,13.2 5.9,5.2 v7.4,3.7
  Top 0.254: v17.1,2.7 U$3.P$39
  Bottom 0.152: v7.85,1.9 7.4,2.35 v7.4,3.7
  Bottom 0.254: U$2.P$39 v17.1,2.7
GPIO8  (via drill 0.3)
  Top 0.152: U1.12 v7.59,14.16 v7.6,14.15
  Top 0.254: v17.7,1.9 U$3.P$40
  Bottom 0.152: v17.7,1.9 17.7,6.2 17.55,6.35 12,6.35 11.8,6.15 11.8,3.05 11.6,2.85 11.6,1.9 11.4,1.7 10.6,1.7 9.35,2.95 9.05,2.95 6.7,5.3 6.4,5.3 4.8,6.9 4.8,8.5 4.2,9.1 4.2,13.65 4.7,14.15 v7.6,14.15
  Bottom 0.254: U$2.P$40 v17.7,1.9
GPIO9  (via drill 0.3)
  Top 0.152: U1.13 v8.41,13.71 v8.4,13.7
  Top 0.254: U$3.P$41 v18.3,2.7
  Bottom 0.152: 18.3,3.65 18.3,6.25 17.8,6.75 11.65,6.75 11.4,6.5 11.4,3.2 11.2,3 11.2,2.2 11.1,2.1 10.75,2.1 9.5,3.35 9.2,3.35 6.5,6.05 6.2,6.05 5.2,7.05 5.2,8.7 4.6,9.3 4.6,13.4 4.9,13.7 7.2,13.7 7.35,13.55 8.25,13.55 v8.4,13.7
  Bottom 0.254: v18.3,2.7 18.3,3.65 U$2.P$41
GPIO10  (via drill 0.3)
  Top 0.152: U1.14 v9.19,14.16 v9.2,14.15
  Top 0.254: v18.9,1.9 U$3.P$42
  Bottom 0.152: U$2.P$42 18.9,6.45 18.2,7.15 11.35,7.15 11,6.8 11,3.35 10.85,3.2 10.25,3.2 9.7,3.75 9.35,3.75 6.6,6.5 6.4,6.5 5.6,7.3 5.6,8.85 5,9.45 5,13.1 5.15,13.25 7.1,13.25 7.2,13.15 8.15,13.15 8.3,13 8.85,13 9.2,13.35 v9.2,14.15
  Bottom 0.254: U$2.P$42 v18.9,1.9
GPIO11  (via drill 0.3)
  Top 0.152: U$3.P$43 19.5,6.2 19.35,6.35 13.95,6.35 13.15,7.15 11.35,7.15 11,6.8 11,5.45 10.6,5.05 10.6,4.55 10.2,4.15 9.5,4.15 7.5,6.15 7.5,11.4 8,11.9 9.65,11.9 11.85,14.1 11.85,15.3 v12.65,16.1 | v13.55,21.7 U1.23
  Top 0.254: v19.5,2.7 U$3.P$43
  Bottom 0.152: v19.51,2.71 v19.5,2.7 | v12.65,16.1 12.65,17.75 10.9,19.5 10.9,21.25 11.35,21.7 v13.55,21.7
  Bottom 0.254: U$2.P$43 v19.5,2.7
GPIO12  (via drill 0.3)
  Top 0.152: U$3.P$44 20.1,6.2 19.55,6.75 14.1,6.75 13.3,7.55 11.2,7.55 10.6,6.95 10.6,5.6 10.15,5.15 9.1,5.15 7.9,6.35 7.9,11 8.3,11.4 9.75,11.4 12.25,13.9 12.25,14.85 v12.65,15.25 | v13.75,22.5 U1.24
  Top 0.254: v20.1,1.9 U$3.P$44
  Bottom 0.152: v12.65,15.25 13.25,15.85 13.25,20.85 13.45,21.05 14.15,21.05 14.35,21.25 14.35,22.3 14.15,22.5 v13.75,22.5
  Bottom 0.254: U$2.P$44 v20.1,1.9
GPIO13  (via drill 0.3, 0.3 pad 0.3)
  Top 0.152: v10.8,25.1 U1.25 | U$6.CD/CS 32.07,20.78 v31.75,21.1
  Bottom 0.152: v10.8,25.1 11.8,26.1 28.95,26.1 31.75,23.3 v31.75,21.1
MISO  (via drill 0.3, 0.3 pad 0.3)
  Top 0.152: U$3.P$32 12.9,6.15 12.7,6.35 12,6.35 11.8,6.15 11.8,5.05 11.4,4.65 11.4,3.2 11.2,3 11.2,2.2 11.1,2.1 10.75,2.1 9.5,3.35 9.2,3.35 6.7,5.85 6.7,12.15 7.25,12.7 9.25,12.7 10.79,14.24 U1.16 10.79,16.41 9.85,17.35 v7.9,17.35 | v4.4,24.5 1.15,24.5 0.9,24.75 0.9,27.45 1.7,28.25 v2.75,28.25 | U$6.DAT0/DO 35.02,15.28 34.7,15.6 34.7,17.35 32.2,19.85 31.5,19.85 30.75,20.6 30.75,23.7 29.2,25.25 28.65,25.25 26.8,23.4 25.65,23.4 24.5,24.55 v23.65,24.55 | v21.7,24.55 21.7,26 v22.85,27.15
  Top 0.254: U$3.P$32 v12.9,1.9
  Bottom 0.152: v12.9,1.9 | v7.9,17.35 5.6,17.35 4.65,18.3 4.65,24.25 v4.4,24.5 | v2.75,28.25 2.75,28.7 3.9,29.85 SV1.1 | SV1.1 3.9,30.2 | v22.85,27.15 22.85,38.6 21.95,39.5 18.1,39.5 13.2,34.6 5.25,34.6 4.5,33.85 3.55,33.85 2.8,33.1 2.8,31.6 3.9,30.5 SV1.1 | v23.65,24.55 v21.7,24.55
  Bottom 0.254: v12.9,1.9 U$2.P$32
MOSI  (via drill 0.3, 0.3 pad 0.3)
  Top 0.152: U$3.P$31 12.18,4.78 11.8,4.4 11.8,3.05 11.6,2.85 11.6,1.9 11.4,1.7 10.6,1.7 9.35,2.95 9.05,2.95 6.3,5.7 6.3,12.55 6.85,13.1 9.05,13.1 10,14.05 U1.15 10.01,16.14 9.4,16.75 v8.5,16.75 | v6.05,27.2 4.55,27.2 3.85,27.9 3.85,28.6 4,28.75 4.35,28.75 4.95,29.35 4.95,30.55 4.4,31.1 1.8,31.1 1.36,31.54 SV1.4 | v34.2,19.65 35.95,19.65 U$6.CMD/DI | v0.6,15 0.25,15.35 0.25,19.55 v0.6,19.85
  Top 0.254: U$3.P$31 v12.3,2.7
  Bottom 0.152: v8.5,16.75 5.75,16.75 3.85,14.85 0.75,14.85 v0.6,15 | SV1.4 1.35,31.55 2.4,30.5 2.4,29.55 0.35,27.5 0.35,23.15 0.6,22.9 v0.6,19.85 | v6.05,27.2 6.15,27.1 7.5,27.1 8.1,26.5 10.1,26.5 10.35,26.25 11,26.25 11.25,26.5 29.1,26.5 32.65,22.95 32.65,21.2 v34.2,19.65
  Bottom 0.254: U$2.P$31 v12.3,2.7
N$1
  Top 0.152: U3.1 18.49,29.96 R5.2 19.54,30.99 R4.1
N$2  (via drill 0.3)
  Top 0.152: U1.8 2.15,16.9 1.82,16.55 1.82,13.35 | v1.5,12.45 1.8,12.75 1.82,13.35 | 1.82,13.35 v1.5,13.65
  Bottom 0.152: C3.1 1.13,11.13 1.5,11.5 v1.5,12.45 | v1.5,13.65 U$4.P$1
N$3  (via drill 0.3)
  Top 0.152: C2.1 0.7,11.03 0.7,14.2 1.46,14.85 1.46,17.23 | 1.46,17.23 1.81,17.69 U1.7 | 1.46,17.23 1.39,17.23 v1.5,17.35
  Bottom 0.152: 1.5,17.4 U$4.P$2 v1.5,17.35
N$4  (via drill 0.3)
  Top 0.254: v13.9,17.7 U1.18 | U$5.1 15.69,18.17 v15.22,17.7
  Bottom 0.254: v15.22,17.7 v13.9,17.7
N$5
  Top 0.254: U2.7 10.72,35.41 C5.2
N$6
  Top 0.254: U2.8 8.87,35.63 C6.2
N$7
  Top 0.254: 8.35,34.08 U2.9 8.37,34.53 8.1,34.8 7,34.8 6.7,35.1 C6.1
N$8  (via drill 0.3)
  Top 0.152: SJ1.2 12.05,28.85 11.45,29.45 10.55,29.45 v10.2,29.8 | v8.75,29.45 8.87,29.57 U2.23
  Bottom 0.152: v10.2,29.8 9.1,29.8 v8.75,29.45
N$9  (via drill 0.3)
  Top 0.152: SJ2.2 v13.35,30.55 | U2.22 8.37,31.52 v8.55,31.7
  Bottom 0.152: v8.55,31.7 12.2,31.7 v13.35,30.55
N$10  (via drill 0.3)
  Top 0.152: U$7.P2 19.85,33.4 18.9,32.45 v18.25,32.45 | v17.5,27.9 U3.3
  Bottom 0.152: v17.5,27.9 17.5,29.9 18.4,30.8 18.4,32.3 v18.25,32.45
N$11
  Top 0.152: U$7.P1 18.85,35.2 19.45,34.6 19.45,33.55 18.95,33.05 17.5,33.05 16.3,31.85 16.3,30.45 17,29.75 17,28.98 U3.4
N$13  (via drill 2 pad 5)
  other vias: 3,3
N$18
  Top 0.152: U$9.P$1 34.9,33.75 34.25,33.1 U$8.P$1
N$19
  Top 0.152: U$8.P$2 32.33,33.53 33.55,34.75 37.85,34.75 U$9.P$4
N$20  (via drill 0.3)
  Top 0.152: v32.8,38.45 33.05,38.2 U$10.P$3 33.15,36.75 31.06,34.66 U$8.P$3
  Bottom 0.152: v32.79,38.46 v32.8,38.45
SCK  (via drill 0.3, 0.3 pad 0.3)
  Top 0.152: U$3.P$33 13.5,6.25 13,6.75 11.65,6.75 11.4,6.5 11.4,5.3 11,4.9 11,3.35 10.85,3.2 10.25,3.2 9.7,3.75 9.35,3.75 7.1,6 7.1,11.7 7.7,12.3 9.45,12.3 11.4,14.25 11.4,16.06 U1.17 11.29,16.91 10.55,17.65 10.55,20.35 v10.1,20.8 | U$6.CLK/SCLK 35.12,17.48 32.35,20.25 31.7,20.25 31.15,20.8 31.15,23.9 29.4,25.65 28.5,25.65 26.65,23.8 25.8,23.8 24.35,25.25 22.7,25.25 22.3,24.85 22.3,24.2 21.65,23.55 18.9,23.55 17,21.65 v17,21.25
  Top 0.254: v13.5,2.7 U$3.P$33
  Bottom 0.152: SV1.3 4.95,31.53 4.95,29.35 4.35,28.75 | 4.35,28.75 3.7,28.75 3.35,28.4 3.35,28 2.95,27.6 1.65,27.6 1.15,27.1 1.15,25.15 1.4,24.9 1.95,24.9 3.65,26.6 7.35,26.6 8.1,25.85 9.55,25.85 9.8,25.6 9.8,24.9 9.65,24.75 9.65,22.6 8.3,21.25 8.3,21.05 8.55,20.8 v10.1,20.8 10.1,21.35 11.9,23.15 14.15,23.15 16.05,21.25 v17,21.25 | 18.85,28.35 17.8,27.3 11.25,27.3 11.05,27.5 10.3,27.5 10.1,27.3 8.6,27.3 7.6,28.3 4.8,28.3 4.35,28.75
  Bottom 0.254: U$2.P$33 v13.5,2.7
SCL  (via drill 0.3, 0.3 pad 0.3)
  Top 0.152: v12.9,12.1 | v9,18.2 v7.25,18.2 | U2.21 7.87,29.33 8.4,28.8 v8.4,25.1 U1.28 8.4,23.1 8.85,22.65 v10.25,22.65 | U3.7 16.99,23.69 16.9,23.6 v15.95,23.6 | U$8.P$6 31.06,26.61 30.85,26.4 28.7,26.4 26.85,24.55 v26,24.55
  Top 0.254: U$3.P$29 v12.9,12.1
  Bottom 0.152: v8.4,25.1 8.4,23.1 7.5,22.2 7.5,18.45 v7.25,18.2 | v9,18.2 10.4,16.8 10.4,14.3 10.8,13.9 10.8,12.65 11.35,12.1 v12.9,12.1 12.9,8 12.45,7.55 11.2,7.55 10.6,6.95 10.6,5.6 10.15,5.15 9.1,5.15 7.9,6.35 7.9,8.05 7.2,8.05 R3.1 | v10.25,22.65 10.25,22.95 10.85,23.55 15.9,23.55 v15.95,23.6 16.85,23.6 17,23.75 17,24.09 16.99,24.1 U3.7 17.64,25.25 25.3,25.25 v26,24.55
  Bottom 0.254: v12.9,12.1 U$2.P$29
SDA  (via drill 0.3, 0.3 pad 0.3)
  Top 0.152: U1.27 v9.2,25.25 9.2,26.5 | 9.2,26.5 9.2,28.7 9.37,28.87 U2.24 | U3.6 v15.7,25.4 | v13,25.5 13,26 12.75,26.25 10.35,26.25 10.1,26.5 9.2,26.5 | v26,25.45 27,25.45 28.9,27.35 U$8.P$5
  Top 0.254: U$3.P$30 v12.3,11.3
  Bottom 0.152: v9.2,25.25 9.2,22.9 7.9,21.6 7.9,18.25 10,16.15 10,14.1 10.4,13.7 10.4,12.3 10.53,12.18 | v15.7,25.4 15.4,25.7 | 15.4,25.7 13.2,25.7 v13,25.5 | R2.1 9.35,11.6 9.55,11.4 9.75,11.4 10.53,12.18 | v12.3,11.3 12.3,11.55 12.15,11.7 11,11.7 10.53,12.18 | 15.4,25.7 25.75,25.7 v26,25.45
  Bottom 0.254: v12.3,11.3 U$2.P$30

### Text on the board
tPlace: + | - | Simple / Space / Systems
bPlace: simplespacesystems.com | Control Board FV2